# Altium schematic sheet Sheet1.SchDoc
size A2; SheetNumber: 1; SheetTotal: 1
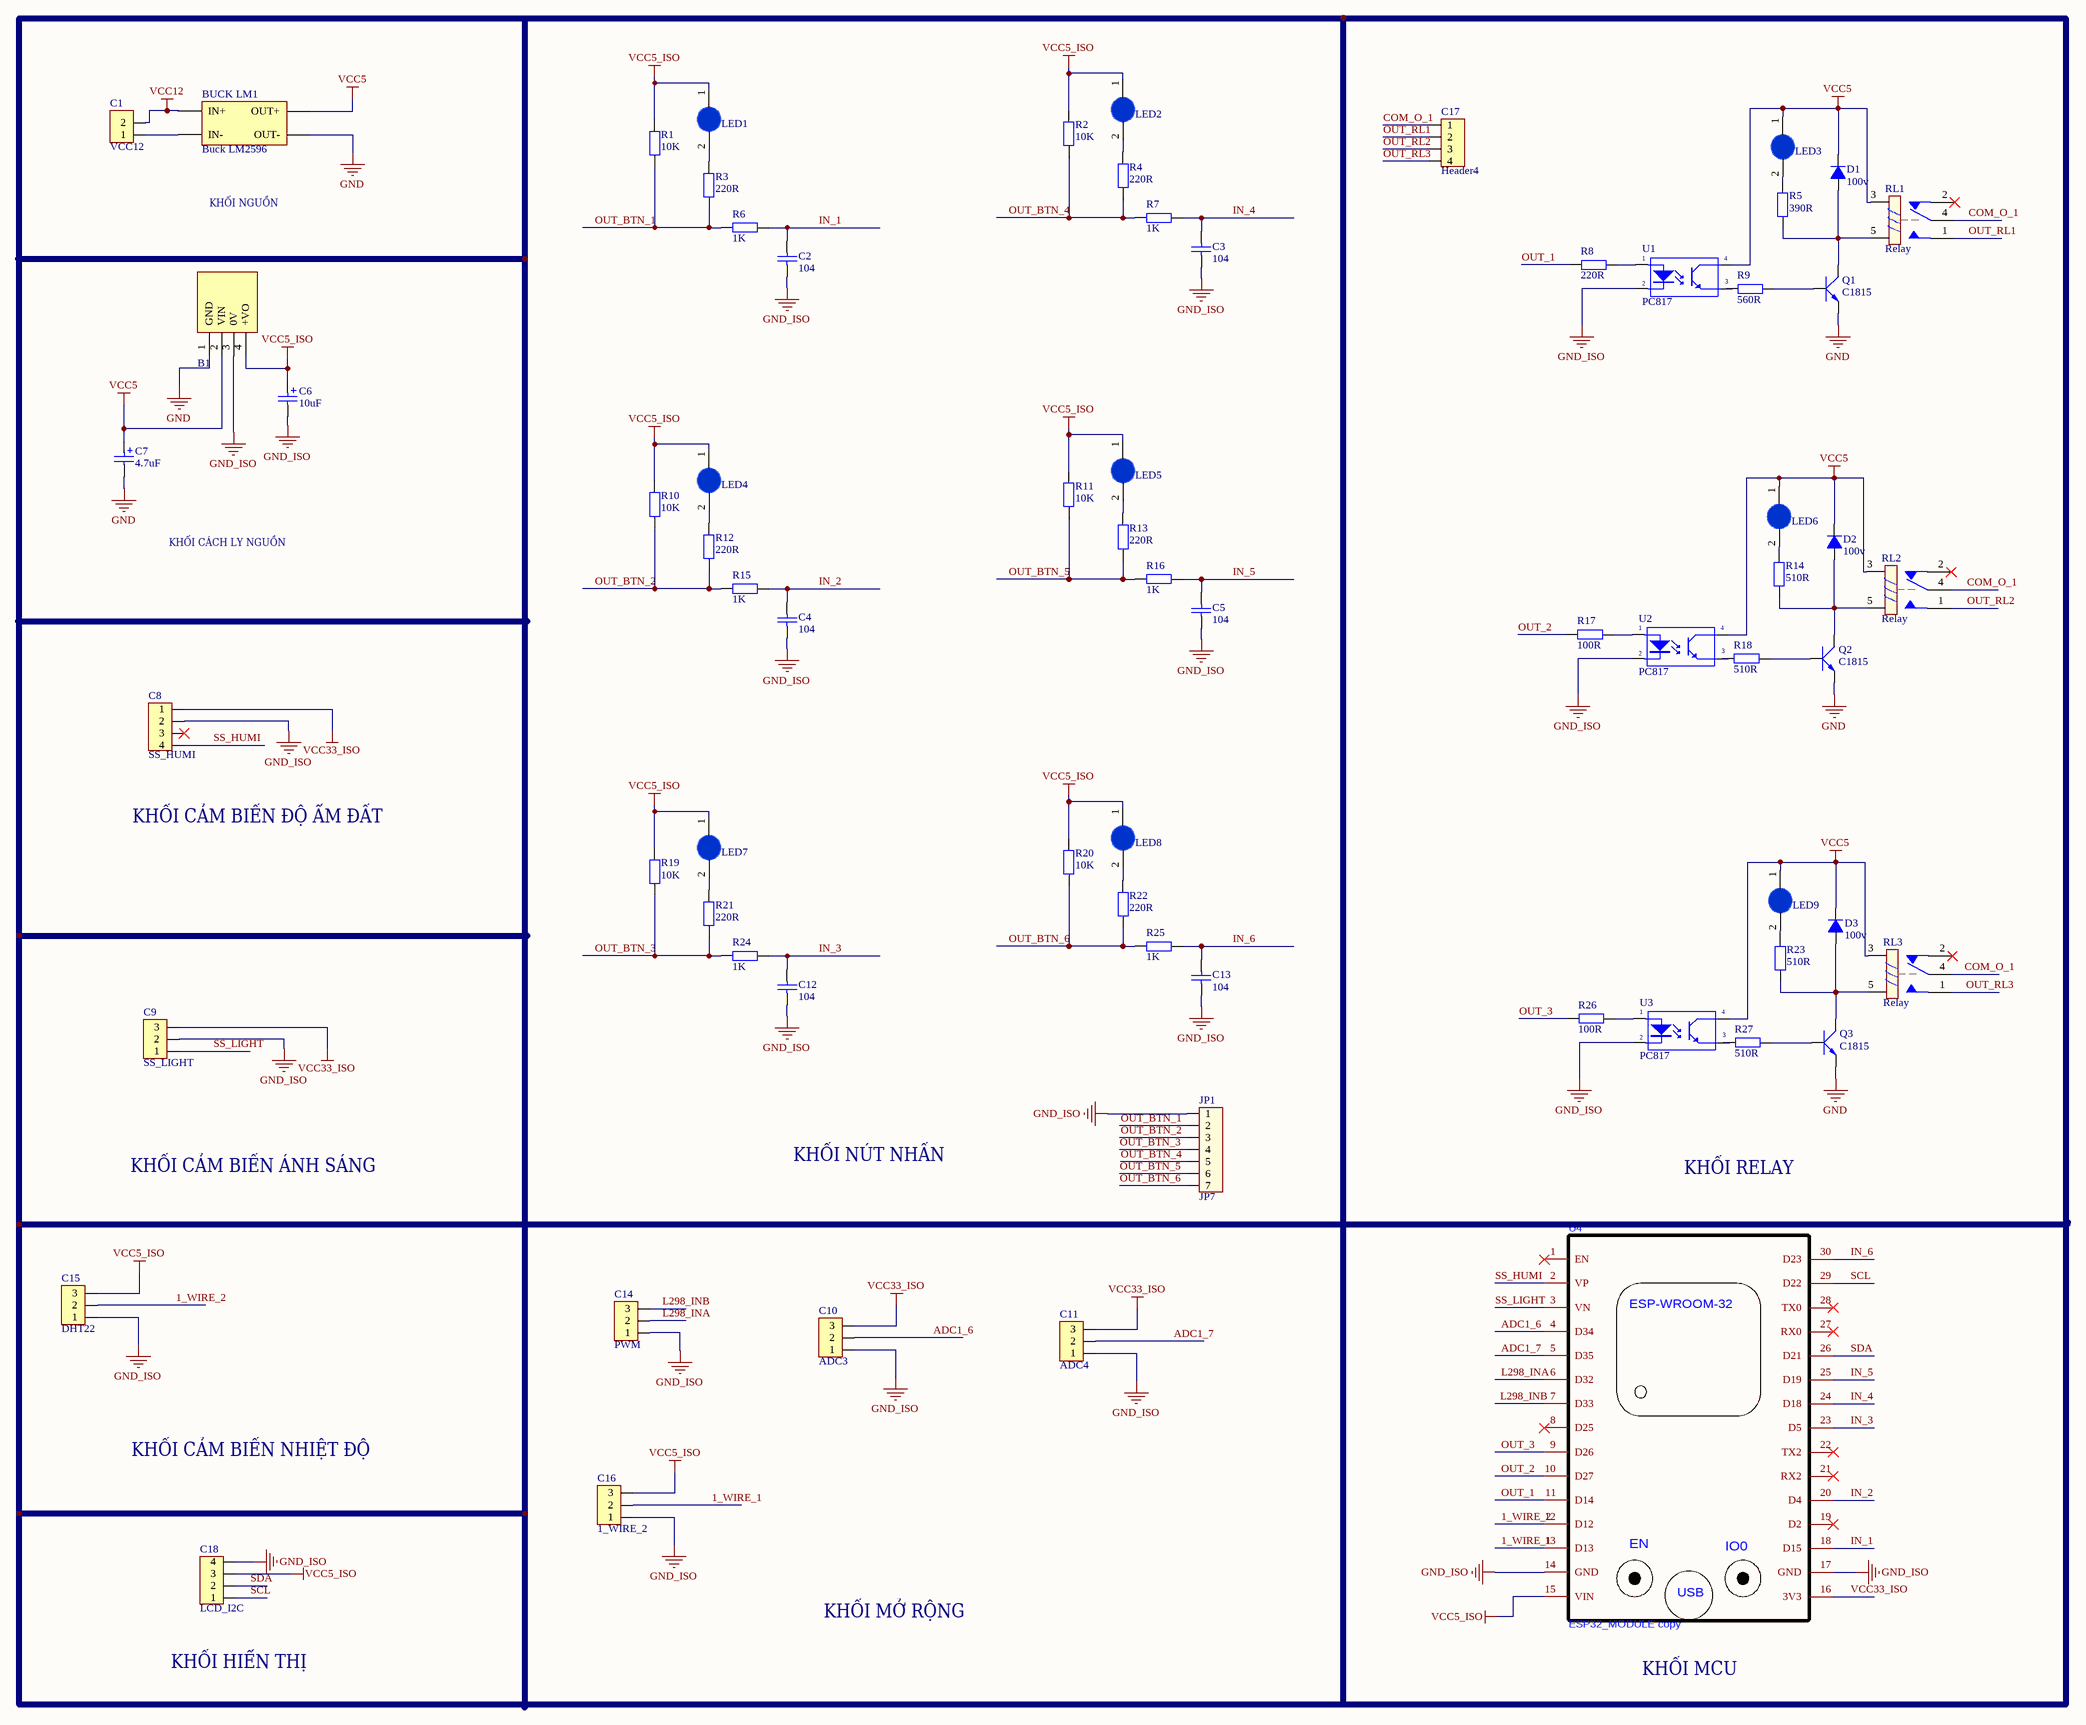
[diagram p0: Sheet1.SchDoc]

## Parts
B1  B0505S1W  [B0505S1W]  (value not drawn)
BUCK_LM1  Buck LM2596  [BUCK LM2596]
C1  VCC12  [Header2]
C2  104  [tu gom]
C3  104  [tu gom]
C4  104  [tu gom]
C5  104  [tu gom]
C6  value 10uF  [CP2/5]  (hidden comment: Cap Pol3)
C7  value 4.7uF  [CP2/5]  (hidden comment: Cap Pol3)
C8  SS_HUMI  [Header4]
C9  SS_LIGHT  [Header3]
C10  ADC3  [Header3]
C11  ADC4  [Header3]
C12  104  [tu gom]
C13  104  [tu gom]
C14  PWM  [Header3]
C15  DHT22  [Header3]
C16  1_WIRE_2  [Header3]
C17  Header4  [Header4]
C18  LCD_I2C  [Header4]
D1  100v  [DIODE 0.5A]
D2  100v  [DIODE 0.5A]
D3  100v  [DIODE 0.5A]
JP1  JP7  [Header7]
LED1  LED 3mm  [LED-3MM-BLUE]  (value not drawn)
LED2  LED 3mm  [LED-3MM-BLUE]  (value not drawn)
LED3  LED 3mm  [LED-3MM-BLUE]  (value not drawn)
LED4  LED 3mm  [LED-3MM-BLUE]  (value not drawn)
LED5  LED 3mm  [LED-3MM-BLUE]  (value not drawn)
LED6  LED 3mm  [LED-3MM-BLUE]  (value not drawn)
LED7  LED 3mm  [LED-3MM-BLUE]  (value not drawn)
LED8  LED 3mm  [LED-3MM-BLUE]  (value not drawn)
LED9  LED 3mm  [LED-3MM-BLUE]  (value not drawn)
Q1  C1815  [C1815_cam]
Q2  C1815  [C1815_cam]
Q3  C1815  [C1815_cam]
R1  10K  [R1/4W]
R2  10K  [R1/4W]
R3  220R  [R1/4W]
R4  220R  [R1/4W]
R5  390R  [R1/4W]
R6  1K  [R1/4W]
R7  1K  [R1/4W]
R8  220R  [R1/4W]
R9  560R  [R1/4W]
R10  10K  [R1/4W]
R11  10K  [R1/4W]
R12  220R  [R1/4W]
R13  220R  [R1/4W]
R14  510R  [R1/4W]
R15  1K  [R1/4W]
R16  1K  [R1/4W]
R17  100R  [R1/4W]
R18  510R  [R1/4W]
R19  10K  [R1/4W]
R20  10K  [R1/4W]
R21  220R  [R1/4W]
R22  220R  [R1/4W]
R23  510R  [R1/4W]
R24  1K  [R1/4W]
R25  1K  [R1/4W]
R26  100R  [R1/4W]
R27  510R  [R1/4W]
RL1  Relay  [RELAY_SRA_05VDC_SL_C]
RL2  Relay  [RELAY_SRA_05VDC_SL_C]
RL3  Relay  [RELAY_SRA_05VDC_SL_C]
U1  PC817  [DIP4/W0.3]
U2  PC817  [DIP4/W0.3]
U3  PC817  [DIP4/W0.3]
U4  ESP32_MODULE copy  [ESP32-WIFIMODULE-FOOTPRINT]

## Nets
GND: B1.1(GND) BUCK_LM1.3(OUT-) C7.2 Q1.1(E) Q2.1(E) Q3.1(E)
GND_ISO: B1.3(0V) C2.2 C3.2 C4.2 C5.2 C6.2 C8.2 C9.2 C10.1 C11.1 C12.2 C13.2 C14.1 C15.1 C16.1 C18.4 JP1.1 U1.2(K) U2.2(K) U3.2(K) U4.14(GND) U4.17(GND)
VCC5: B1.2(VIN) BUCK_LM1.4(OUT+) C7.1 D1.2(K) D2.2(K) D3.2(K) LED3.1(A) LED6.1(A) LED9.1(A) RL1.3 RL2.3 RL3.3 U1.4(C) U2.4(C) U3.4(C)
VCC5_ISO: B1.4(+VO) C6.1 C15.3 C16.3 C18.3 LED1.1(A) LED2.1(A) LED4.1(A) LED5.1(A) LED7.1(A) LED8.1(A) R1.2 R2.2 R10.2 R11.2 R19.2 R20.2 U4.15(VIN)
VCC12: BUCK_LM1.1(IN+) C1.2
VCC33_ISO: C8.1 C9.3 C10.3 C11.3 U4.16(3V3)
1_WIRE_1: C16.2 U4.13(D13)
1_WIRE_2: C15.2 U4.12(D12)
ADC1_6: C10.2 U4.4(D34)
ADC1_7: C11.2 U4.5(D35)
COM_O_1: C17.1 RL1.4 RL2.4 RL3.4
IN_1: C2.1 R6.1 U4.18(D15)
IN_2: C4.1 R15.1 U4.20(D4)
IN_3: C12.1 R24.1 U4.23(D5)
IN_4: C3.1 R7.1 U4.24(D18)
IN_5: C5.1 R16.1 U4.25(D19)
IN_6: C13.1 R25.1 U4.30(D23)
L298_INA: C14.2 U4.6(D32)
L298_INB: C14.3 U4.7(D33)
OUT_1: R8.1 U4.11(D14)
OUT_2: R17.1 U4.10(D27)
OUT_3: R26.1 U4.9(D26)
OUT_BTN_1: JP1.2 R1.1 R3.1 R6.2
OUT_BTN_2: JP1.3 R10.1 R12.1 R15.2
OUT_BTN_3: JP1.4 R19.1 R21.1 R24.2
OUT_BTN_4: JP1.5 R2.1 R4.1 R7.2
OUT_BTN_5: JP1.6 R11.1 R13.1 R16.2
OUT_BTN_6: JP1.7 R20.1 R22.1 R25.2
OUT_RL1: C17.2 RL1.1
OUT_RL2: C17.3 RL2.1
OUT_RL3: C17.4 RL3.1
SCL: C18.1 U4.29(D22)
SDA: C18.2 U4.26(D21)
SS_HUMI: C8.4 U4.2(VP)
SS_LIGHT: C9.1 U4.3(VN)
NetBUCK_LM1_2: BUCK_LM1.2(IN-) C1.1
NetD1_1: D1.1(A) Q1.2(C) R5.2 RL1.5
NetD2_1: D2.1(A) Q2.2(C) R14.2 RL2.5
NetD3_1: D3.1(A) Q3.2(C) R23.2 RL3.5
NetLED1_2: LED1.2(K) R3.2
NetLED2_2: LED2.2(K) R4.2
NetLED3_2: LED3.2(K) R5.1
NetLED4_2: LED4.2(K) R12.2
NetLED5_2: LED5.2(K) R13.2
NetLED6_2: LED6.2(K) R14.1
NetLED7_2: LED7.2(K) R21.2
NetLED8_2: LED8.2(K) R22.2
NetLED9_2: LED9.2(K) R23.1
NetQ1_3: Q1.3(B) R9.2
NetQ2_3: Q2.3(B) R18.2
NetQ3_3: Q3.3(B) R27.2
NetR8_2: R8.2 U1.1(A)
NetR9_1: R9.1 U1.3(E)
NetR17_2: R17.2 U2.1(A)
NetR18_1: R18.1 U2.3(E)
NetR26_2: R26.2 U3.1(A)
NetR27_1: R27.1 U3.3(E)

Not connected (* = marked no-connect by the designer): C8 3*; RL1 2*; RL2 2*; RL3 2*; U4 1(EN)* 8(D25)* 19(D2)* 21(RX2)* 22(TX2)* 27(RX0)* 28(TX0)*

## Notes on the sheet
- KHỐI NGUỒN
- KHỐI CÁCH LY NGUỒN
- KHỐI CẢM BIẾN ĐỘ ẨM ĐẤT
- KHỐI CẢM BIẾN ÁNH SÁNG
- KHỐI NÚT NHẤN
- KHỐI RELAY
- KHỐI CẢM BIẾN NHIỆT ĐỘ
- KHỐI HIỂN THỊ
- KHỐI MỞ RỘNG
- KHỐI MCU
- (in symbol ESP32_MODULE copy) ESP-WROOM-32; IO0; USB

## Library data of the parts
B1 = B0505S1W: Power Supply; Manufacturer_Name: Mornsun; Manufacturer_Part_Number: B0505S-1W; Datasheet Link: https://www.mornsun-power.com/uploads/pdf/B_D-1W.pdf; Height: 10.41mm
C1 = Header2: Header IDC, 2 x 1 Pin Vertical 2.54mm Pitch (Non-Boxed, Male); Manufacturer: W¨¹rth Elektronik eiSos GmbH; partNo: 613002143121; ComponentLink1 Description: Manufacturer; ComponentLink2 Description: Datasheet; NoPins: 02; Created Date: 29 March 2013; ComponentLink1URL: http://www.we-online.com; ComponentLink2URL: http://katalog.we-online.de/em/datasheet/6130xx143121.pdf; Created by: Karrer Zheng
C2-C5 C12 C13 = Tu gom 104 50V: Cắm; So_Chan: 2; Ten_Linh_Kien: Tụ gốm 104 100nF 50V; Don_Vi: Con; Ma_Hang: MH004761; Chung_Loai: Cắm; Kieu_Chan: *
C6 C7 = Cap Pol3: Polarized Capacitor (Surface Mount); VALUE: C?; LatestRevisionDate: 17-Jul-2002; LatestRevisionNote: Re-released for DXP Platform.; PackageReference: C0805; Publisher: Altium Limited
C8 C17 C18 = Header4: Header IDC, 4 x 1 Pin Vertical 2.54mm Pitch (Non-Boxed, Male); Manufacturer: W¨¹rth Elektronik eiSos GmbH; partNo: 613002143121; ComponentLink1 Description: Manufacturer; ComponentLink2 Description: Datasheet; NoPins: 02; Created Date: 29 March 2013; ComponentLink1URL: http://www.we-online.com; ComponentLink2URL: http://katalog.we-online.de/em/datasheet/6130xx143121.pdf; Created by: Karrer Zheng
C9-C11 C14-C16 = Header3: Header IDC, 3 x 1 Pin Vertical 2.54mm Pitch (Non-Boxed, Male); Manufacturer: W¨¹rth Elektronik eiSos GmbH; partNo: 613002143121; ComponentLink1 Description: Manufacturer; ComponentLink2 Description: Datasheet; NoPins: 02; Created Date: 29 March 2013; ComponentLink1URL: http://www.we-online.com; ComponentLink2URL: http://katalog.we-online.de/em/datasheet/6130xx143121.pdf; Created by: Karrer Zheng
D1-D3 = Diode 1N4148: Cắm; Ten_Linh_Kien: Diode 1N4148 DO35 450mA 100V ( 1N4148 DIP); Don_Vi: Con; Ma_Hang: MH001065; Ghi Chu: *; Kieu_Chan: *; Chung_Loai: Cắm
JP1 = Header7: Connector 7; Value: Connector 7
LED1-LED9 = LED 3mm Xanh Duong: Cắm; Don_Vi: Con; Ma_Hang: MH009003; Ten_Linh_Kien: LED 3MM Xanh Dương SS (1000c); Ghi_Chu: *; Kieu_Chan: *; Chung_Loai: Cắm
Q1-Q3 = C1815: NPN 600mW, ECB; Value: C1815
R1-R27 = R1/4W: Resistor 1/4W; Value: R1/4W - 1K
RL1-RL3 = RL_SRA-05VDC-SL-C: Relay 5 Chan; Ma_Hang: MH009374; Ten: Relay 5V10A SRD-05VDC-SL-C Chính Hãng
U1-U3 = PC817: Single Opto; Value: PC817